# EAGLE design dsky_md_2.3v (EAGLE 6.5.0)
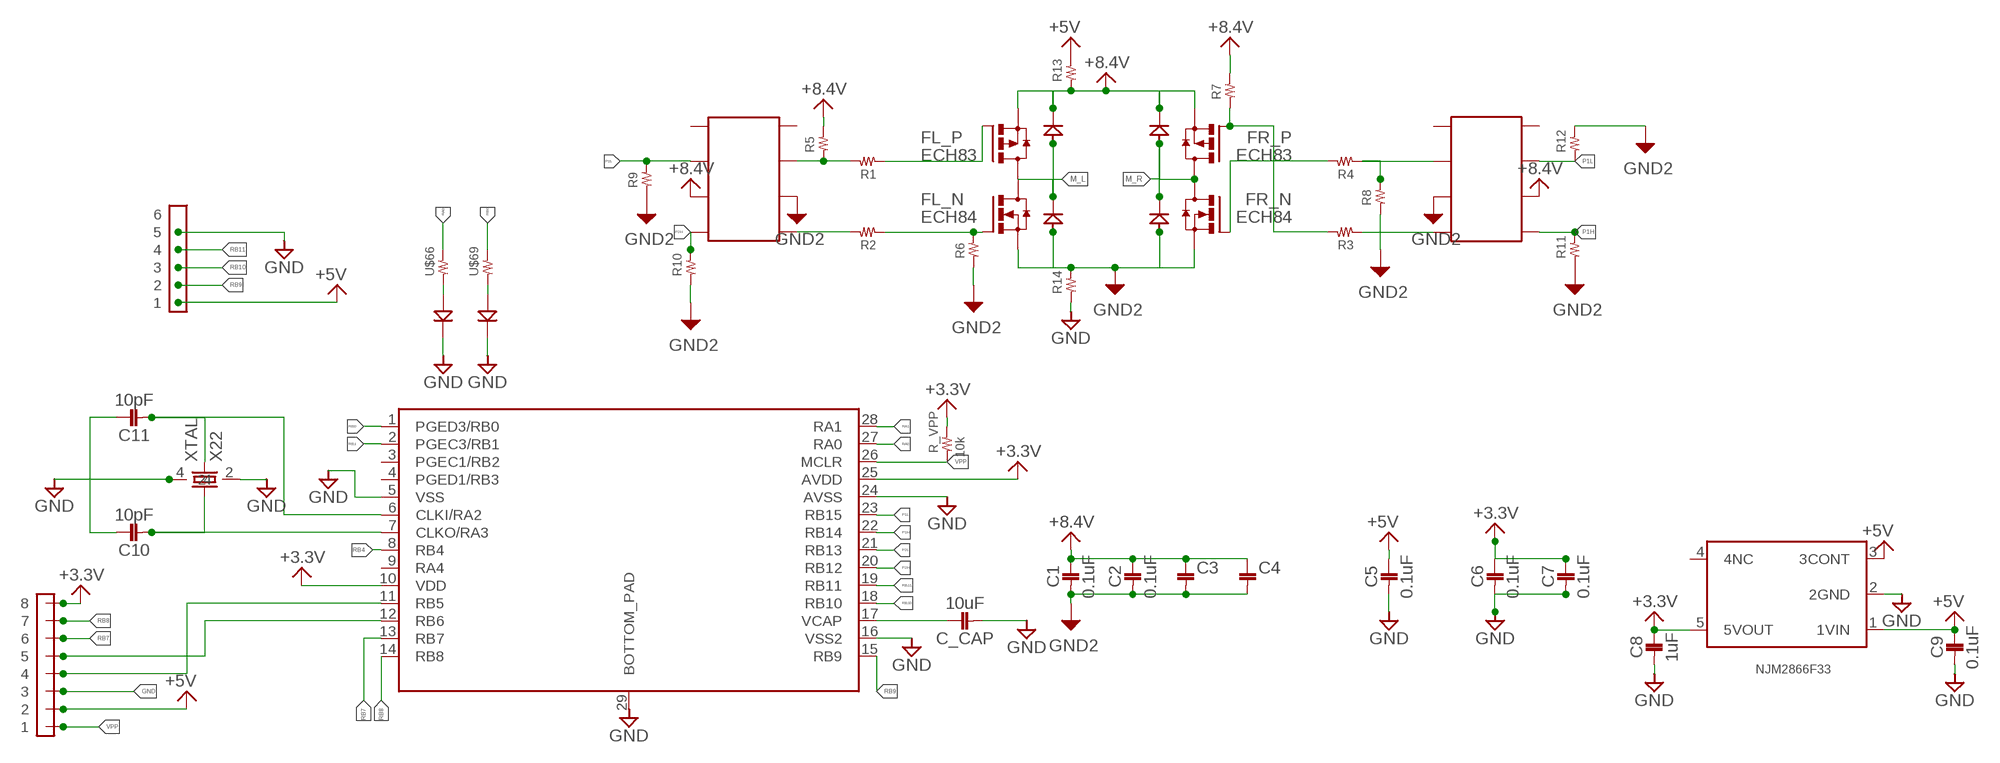
[diagram p0: schematic, sheet 1]

## Parts
C1  0.1uF  1608  [1608]
C2  0.1uF  1608  [1608]
C3  2012  [2012]
C4  2012  [2012]
C5  0.1uF  1608  [1608]
C6  0.1uF  1608  [1608]
C7  0.1uF  1608  [1608]
C8  1uF  1608  [1608]
C9  0.1uF  1608  [1608]
C10  10pF  1608  [1608]
C11  10pF  1608  [1608]
C_CAP  10uF  1608  [1608]
FL_N  ECH84  [ECH8]
FL_P  ECH83  [ECH8]
FR_N  ECH84  [ECH8]
FR_P  ECH83  [ECH8]
IC_L  TC1427COA  [SOIC8]
IC_R  TC1427COA  [SOIC8]
NJM2866F33  TAR5SB  [SSOP5-P-0.95]
R1  RESISTOR__SMD  [1608]
R2  RESISTOR__SMD  [1608]
R3  RESISTOR__SMD  [1608]
R4  RESISTOR__SMD  [1608]
R5  RESISTOR__SMD  [1608]
R6  RESISTOR__SMD  [1608]
R7  RESISTOR__SMD  [1608]
R8  RESISTOR__SMD  [1608]
R9  RESISTOR__SMD  [1608]
R10  RESISTOR__SMD  [1608]
R11  RESISTOR__SMD  [1608]
R12  RESISTOR__SMD  [1608]
R13  RESISTOR__SMD  [1608]
R14  RESISTOR__SMD  [1608]
R_VPP  10k  RESISTOR__SMD  [1608]
U$3  SS2040  [SOD-123FL]
U$5  DSPIC33EP32MC202  [QFN-S28_6X6MC]
U$6  1608  [1608]
U$16  1608  [1608]
U$44  FH12-6S-0.5  [FPC6]
U$66  RESISTOR__SMD  [1608]
U$69  RESISTOR__SMD  [1608]
U$70  SS2040  [SOD-123FL]
U$71  SS2040  [SOD-123FL]
U$73  SS2040  [SOD-123FL]
U$80  PIN_HEADER_8  [PIN_HEADER_8]
XTAL  X22  [SMD_X22]

## Nets
+3.3V: C6.P$1 C7.P$1 C8.P$1 NJM2866F33.5(5VOUT) R_VPP.2 U$5.10(VDD) U$5.25(AVDD) U$80.8
+5V: C5.P$1 C9.P$1 NJM2866F33.1(1VIN) NJM2866F33.3(3CONT) R13.2 U$44.P1 U$80.2
+8.4V: C1.P$1 C2.P$1 C3.1 C4.1 FL_P.1(S) FL_P.2(S) FL_P.3(S) FR_P.1(S) FR_P.2(S) FR_P.3(S) IC_L.3(3_GND) IC_R.3(3_GND) R5.2 R7.2 R13.1 U$70.2(PK) U$73.2(PK)
GND: C5.P$2 C6.P$2 C7.P$2 C8.P$2 C9.P$2 C10.P$1 C11.P$1 C_CAP.P$2 NJM2866F33.2(2GND) R14.1 U$5.5(VSS) U$5.16(VSS2) U$5.24(AVSS) U$5.29(BOTTOM_PAD) U$6.2(K) U$16.2(K) U$44.P5 U$44.P_NC1 U$44.P_NC2 U$80.3 XTAL.2 XTAL.4
GND2: C1.P$2 C2.P$2 C3.2 C4.2 FL_N.1(S) FL_N.2(S) FL_N.3(S) FR_N.1(S) FR_N.2(S) FR_N.3(S) IC_L.6(6_VDD) IC_R.6(6_VDD) R6.1 R8.1 R9.1 R10.1 R11.1 R12.2 R14.2 U$3.1(PA) U$71.1(PA)
M_L: FL_N.5(D) FL_N.6(D) FL_N.7(D) FL_N.8(D) FL_P.5(D) FL_P.6(D) FL_P.7(D) FL_P.8(D) U$3.2(PK) U$70.1(PA)
M_R: FR_N.5(D) FR_N.6(D) FR_N.7(D) FR_N.8(D) FR_P.5(D) FR_P.6(D) FR_P.7(D) FR_P.8(D) U$71.2(PK) U$73.1(PA)
N$1: FL_P.4(G) R1.1
N$2: FL_N.4(G) R2.1 R6.2
N$3: IC_L.7(7_OUT_A) R1.2 R5.1
N$4: FR_P.4(G) R3.2 R7.1
N$5: IC_L.5(5_OUT_B) R2.2
N$6: IC_R.7(7_OUT_A) R4.1 R8.2
N$7: C_CAP.P$1 U$5.17(VCAP)
N$8: C10.P$2 U$5.7(CLKO/RA3) XTAL.1
N$9: IC_R.5(5_OUT_B) R3.1
N$10: U$5.11(RB5) U$80.4
N$11: U$5.12(RB6) U$80.5
N$12: FR_N.4(G) R4.2
N$13: C11.P$2 U$5.6(CLKI/RA2) XTAL.3
N$14: U$6.1(A) U$66.1
N$16: U$16.1(A) U$69.1
P1H: IC_R.4(4_IN_B) R11.2 U$5.22(RB14)
P1L: IC_R.2(2_IN_A) R12.1 U$5.23(RB15)
P2H: IC_L.4(4_IN_B) R10.2 U$5.20(RB12)
P2L: IC_L.2(2_IN_A) R9.2 U$5.21(RB13)
RA0: U$5.27(RA0) U$66.2
RA1: U$5.28(RA1)
RB0: U$5.1(PGED3/RB0) U$69.2
RB1: U$5.2(PGEC3/RB1)
RB4: U$5.8(RB4)
RB7: U$5.13(RB7) U$80.6
RB8: U$5.14(RB8) U$80.7
RB9: U$5.15(RB9) U$44.P2
RB10: U$5.18(RB10) U$44.P3
RB11: U$5.19(RB11) U$44.P4
VPP: R_VPP.1 U$5.26(MCLR) U$80.1
Unconnected: IC_L.1(1_NC) IC_L.8(8_NC) IC_R.1(1_NC) IC_R.8(8_NC) NJM2866F33.4(4NC) U$5.3(PGEC1/RB2) U$5.4(PGED1/RB3) U$5.9(RA4) U$44.P6

## Library data of the parts
C1 C2 C5-C11 C_CAP = 02_C:1608
C3 C4 = 02_C:2012
FL_N FR_N = 06_FET:ECH84
FL_P FR_P = 06_FET:ECH83
IC_L IC_R = 04_IC:TC1427COA
NJM2866F33 = 04_IC:TAR5SB
R1-R14 R_VPP U$66 U$69 = 01_R:RESISTOR__SMD
U$3 U$70 U$71 U$73 = DIODE:SS2040
U$5 = microchip-dspic:DSPIC33EP32MC202
U$6 U$16 = LED:1608
U$44 = 08_CONECTOR:FH12-6S-0.5
U$80 = 08_CONECTOR:PIN_HEADER_8
XTAL = 09_2_CRYSTAL:X22

## Board
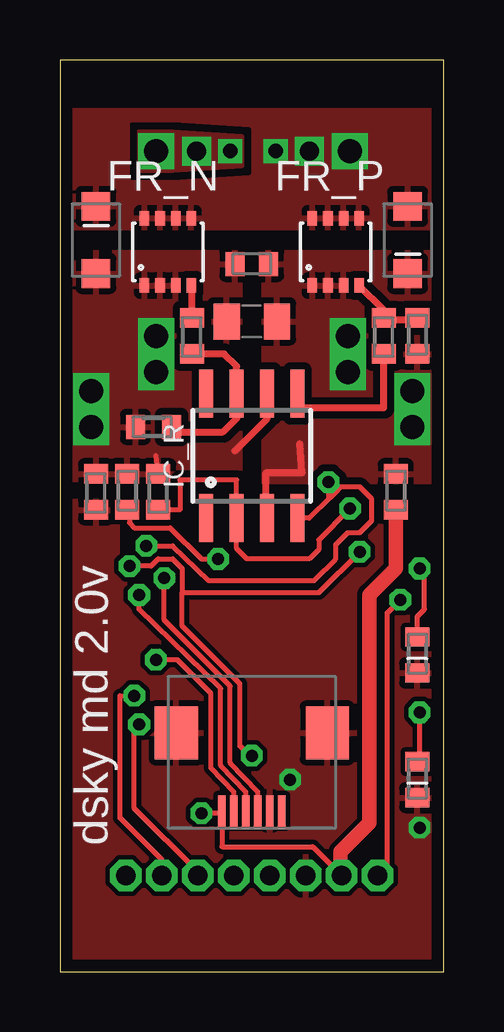
[diagram p1: board, top side]
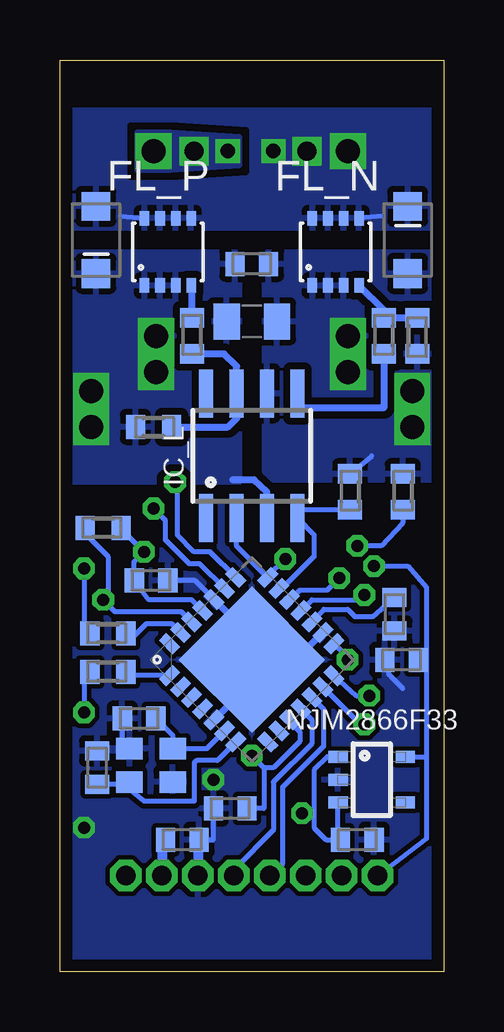
[diagram p2: board, bottom side, seen from below]

Size 16 x 38 mm. Coordinates in mm from the lower left corner, seen from the top.
Outline: 0,0 16,0 16,38 0,38 0,0
Copper layers (1*16): Top 0.035mm / dielectric 1.5mm / Bottom 0.035mm
Design rules "default *": minimum track width 6mil, minimum drill 12mil, track to track 6mil, track to pad 6mil, pad to pad 6mil, via to via 6mil, smd to smd 8mil, copper to edge 20mil, drill to drill 8mil, minimum pad ring 10mil, minimum via ring 8mil, stop-mask expansion 4mil, vias tented up to drill 0mil, thermal gap 10mil

### Footprints (pad centres in the part's own frame; a part is rotated, then mirrored left to right if it is on the bottom)
1608 = smd 0.8 x 1: P$1 -0.7,0; P$2 0.7,0
2012 = smd 1.1 x 1.5: 1 -1.05,0; 2 1.05,0
ECH8 = smd 0.4 x 0.6: 1 -0.975,-1.4; 2 -0.325,-1.4; 3 0.325,-1.4; 4 0.975,-1.4; 5 0.975,1.4; 6 0.325,1.4; 7 -0.325,1.4; 8 -0.975,1.4
SOIC8 = smd 0.6 x 2: 1 -1.905,-2.6; 2 -0.635,-2.6; 3 0.635,-2.6; 4 1.905,-2.6; 5 1.905,2.6; 6 0.635,2.6; 7 -0.635,2.6; 8 -1.905,2.6
SSOP5-P-0.95 = smd 0.5 x 0.8: 1 -0.95,-1.4; 2 0,-1.4; 3 0.95,-1.4; 4 0.95,1.4; 5 -0.95,1.4
1608' = smd 0.8 x 1: 1 -0.75,0; 2 0.75,0
SOD-123FL = smd 1.2 x 1.2: 1 -1.4,0; 2 1.4,0
QFN-S28_6X6MC = smd 0.813 x 0.432: 1 -2.896,1.956; 2 -2.896,1.295; 3 -2.896,0.66; 4 -2.896,0; 5 -2.896,-0.66; 6 -2.896,-1.295; 7 -2.896,-1.956; 15 2.896,-1.956; 16 2.896,-1.295; 17 2.896,-0.66; 18 2.896,0; 19 2.896,0.66; 20 2.896,1.295; 21 2.896,1.956 | smd 0.432 x 0.813: 8 -1.956,-2.896; 9 -1.295,-2.896; 10 -0.66,-2.896; 11 0,-2.896; 12 0.66,-2.896; 13 1.295,-2.896; 14 1.956,-2.896; 22 1.956,2.896; 23 1.295,2.896; 24 0.66,2.896; 25 0,2.896; 26 -0.66,2.896; 27 -1.295,2.896; 28 -1.956,2.896 | smd 4.318 x 4.318: 29 0,0
FPC6 = smd 0.3 x 1.3: P1 -1.25,0; P2 -0.75,0; P3 -0.25,0; P4 0.25,0; P5 0.75,0; P6 1.25,0 | smd 1.8 x 2.2: P_NC1 3.15,3.25; P_NC2 -3.15,3.25
PIN_HEADER_8 = drill 0.8 octagon: 1 -4.5,0; 2 -3,0; 3 -1.5,0; 4 0,0; 5 1.5,0; 6 3,0; 7 4.5,0; 8 6,0
SMD_X22 = smd 1.1 x 0.9: 1 -0.9,-0.7; 2 0.9,-0.7; 3 0.9,0.7; 4 -0.9,0.7

### Placement (x,y rotation side)
C1  8,29.5 180 top
C2  8,29.5 0 bottom
C3  8,27.1 0 bottom
C4  8,27.1 180 top
C5  10.9,5.5 0 bottom
C6  12.2,16.3 0 bottom
C7  8.9,6.8 180 bottom
C8  1.75,13 180 bottom
C9  3.6,5.5 0 bottom
C10  14.45,8.5 270 bottom
C11  12.7,10.55 0 bottom
C_CAP  2.05,14.9 270 bottom
FL_N  4.5,30 0 bottom
FL_P  11.5,30 0 bottom
FR_N  4.5,30 0 top
FR_P  11.5,30 0 top
IC_L  8,21.5 0 bottom
IC_R  8,21.5 0 top
NJM2866F33  3,8 270 bottom
R1  [1608']  10.5,26.5 270 bottom
R2  [1608']  2.5,26.5 270 bottom
R3  [1608']  13.5,26.5 90 top
R4  [1608']  5.5,26.5 90 top
R5  [1608']  12.1,22.7 180 bottom
R6  [1608']  1.1,26.5 90 bottom
R7  [1608']  14.9,26.5 270 top
R8  [1608']  3.9,22.7 0 top
R9  [1608']  2.8,20 270 top
R10  [1608']  3.9,20 270 bottom
R11  [1608']  1.7,20 270 bottom
R12  [1608']  4.1,20 90 top
R13  [1608']  14,20 270 top
R14  [1608']  1.5,20 90 top
R_VPP  10k  [1608']  14.2,18.5 0 bottom
U$3  1.5,30.5 90 bottom
U$5  8,13 45 bottom
U$6  1608  [1608']  14.9,13.2 270 top
U$16  1608  [1608']  14.9,8 270 top
U$44  8,6.7 0 top
U$66  [1608']  14,14.1 0 bottom
U$69  [1608']  14,12.5 0 bottom
U$70  14.5,30.5 270 bottom
U$71  1.5,30.5 90 top
U$73  14.5,30.5 270 top
U$80  8.75,4 180 top
XTAL  12.2,8.6 0 bottom

### Tracks (layer width: path | path; a pad name or v marks a point on that pad's centre or on a via)
+3.3V  (via drill 0.5)
  Top 0.2: v8,9 8,8.9 7.5,9.4 7.5,12 5.1,14.4 5.1,15.8 | v2.9,16.9 3.8,16.9 4.1,17.2 4.7,17.2 5.1,16.8 5.1,15.8 | 5.1,15.8 10.8,15.8 v12.5,17.5
  Bottom 0.2: U$5.25 10.5,15.5 12.3,15.5 C6.P$1 12.9,17.1 v12.5,17.5 13.25,18.25 R_VPP.2 | U$5.10 6.42,10.42 6,10 6,9.6 7.1,8.5 7.5,8.5 | 7.5,8.5 v8,9 | 7.5,8.5 7.5,6.8 C7.P$1 | 0.7,8.95 0.7,12.6 | 0.7,12.6 0.7,16 1.5,16.9 v2.9,16.9 | NJM2866F33.5 0.7,8.95 | U$80.8 0.7,5.55 0.7,8.95 | C8.P$1 0.7,12.6
+5V  (via drill 0.5)
  Top 0.2: 11.75,5.2 U$80.2 10.55,5.2 6.75,5.2 U$44.P1 6.65,6.6 v5.9,6.6
  Top 0.6: R13.2 14,16.8 12.9,15.7 12.9,6.2 11.7,5 11.7,4.05 U$80.2
  Bottom 0.2: 4.35,8.95 NJM2866F33.1 4.85,8.95 5.4,8.4 5.4,6.6 | NJM2866F33.3 4.4,5.5 C9.P$1 4.9,5.5 5.4,6 5.4,6.6 | v5.9,6.6 5.4,6.6
  Bottom 0.406: C5.P$1 11.75,5.3 U$80.2
+8.4V  (via drill 1)
  Top 0.3: IC_R.3 8.6,18.9 8.6,20.8 10.1,20.8 10,22
  Bottom 0.3: IC_L.3 7.37,20 7.9,20.5 8.8,20.5
  other vias: 12,26.5 12,25 14.7,22.7 14.7,24.2
  pour Bottom (isolate 0.3): 8.5,30 16,30 16,20.4 8.5,20.4
  pour Top (isolate 0.3): 8.5,30 16,30 16,20.4 8.5,20.4
GND  (via drill 0.5)
  Bottom 0.2: C11.P$1 13.4,9.6 XTAL.4 | 1.7,11.8 2.3,12.4 2.3,12.6 2.45,12.6 C8.P$2 | U$5.24 10.37,16.3 C6.P$2 | C5.P$2 9.6,5.5 C7.P$2
  Bottom 0.3: U$5.5 8,12.07 U$5.29 | U$5.24 8,13.93 U$5.29 | U$5.16 6.17,13 U$5.29
  Bottom 0.406: C5.P$2 10.25,5.3 U$80.3
  other vias: 15,6 9.6,8
  pour Top (isolate 0.2): 0,0 16,0 16,19.6 3,19.6 3,17.3 2.4,17.3 2.4,19.6 0,19.6
  pour Bottom (isolate 0.2): 0,0 16,0 16,19.6 0,19.6
GND2  (via drill 1)
  Top 0.2: R12.2 4,21.5
  Top 0.3: IC_R.6 8.63,23.04 7.3,21.7
  Bottom 0.2: R10.1 3,21.5
  other vias: 4,26.5 4,25 1.3,22.7 1.3,24.2
  pour Bottom (isolate 0.3): 0,30 7.5,30 7.5,20.5 0,20.5
  pour Top (isolate 0.3): 0,30 7.5,30 7.5,20.5 0,20.5
M_L  (via drill 0.6, 0.8, 1)
  Bottom 0.2: 2.52,31.5 FL_N.5 | 13.47,31.5 FL_P.8
  other vias: 5.7,34.2 4,34.2 7.1,34.2
  pour Bottom (isolate 0.3, rank 2): 0,35.9 16,35.9 16,31 0,31
  pour Top: 3.3,35 3.3,33.4 4.7,33.4 7.6,33.6 7.6,34.8 4.7,35
M_R  (via drill 0.6, 0.8, 1)
  other vias: 10.4,34.2 12.1,34.2 9,34.2
  pour Top (isolate 0.3, rank 2): 0,35.9 16,35.9 16,31 0,31
  pour Bottom: 8.5,34.8 11.4,35 12.8,35 12.8,33.4 11.4,33.4 8.5,33.6
N$1
  Bottom 0.2: 10.5,28.57 FL_P.4
  Bottom 0.3: R1.1 10.5,28.57
N$2
  Bottom 0.3: R6.2 R2.1 2.5,27.57 FL_N.4
N$3
  Bottom 0.3: R1.2 9.15,25.75 8.63,25.23 IC_L.7 8.6,24.07 8.6,23.1 9,22.7 R5.1
N$4
  Top 0.3: R7.1 14.9,27.15 14,27.15 R3.2 13.5,27.57 FR_P.4
N$5
  Bottom 0.3: R2.2 2.5,23.5 6,23.5 6,24.1 IC_L.5
N$6
  Top 0.3: R4.1 6.85,25.75 7.37,25.23 IC_R.7 7.4,24.07 7.4,23.1 6.8,22.5 4.7,22.5 R8.2
N$7
  Bottom 0.2: U$5.17 5.49,14.61 5,15.1 4,15.1 3.7,14.8 2.95,14.8 C_CAP.P$1
N$8
  Bottom 0.2: C10.P$2 13.2,7.8 XTAL.1 13.05,7.55 12.5,7.1 10.4,7.1 10.4,8.7 10.3,8.8 9.43,8.8 U$5.7
N$9
  Top 0.3: IC_R.5 9.9,23.59 10,23.5 13.5,23.5 R3.1
N$10
  Bottom 0.2: U$5.11 5.5,10.5 5.5,9.5 7.1,7.9 7.1,5.9 8.75,4.25 U$80.4
N$11
  Bottom 0.2: U$80.5 7.3,4 6.7,4.5 6.7,7.7 5,9.4 5,10.93 U$5.12
N$12
  Top 0.3: R4.2 5.5,28.6 FR_N.4
N$13
  Bottom 0.2: U$5.6 9.87,9.3 XTAL.3 11.3,9.85 C11.P$2
N$14  (via drill 0.5)
  Top 0.2: U$6.1 14.9,14.8 15.2,15.1 15.2,16.6 v15,16.8
  Bottom 0.2: v15,16.8 15,14.35 U$66.1
N$16  (via drill 0.5)
  Top 0.2: v15,10.8 15,8.85 U$16.1
  Bottom 0.2: U$69.1 15,12.25 v15,10.8
P1H  (via drill 0.5)
  Top 0.2: v3.6,17.75 4.7,17.75 6.2,16.3 10.6,16.3 11.5,17.2 11.5,17.8 12,18.3 12.5,18.3 13,18.8 13,19.7 12.5,20.2 11.7,20.2 11.5,20 | 11.5,20 11.25,19.75 | 11.25,19.75 10.4,18.9 IC_R.4 | 11.4,20 11.5,20 | v11.2,20.4 11.2,19.8 arc90 11.25,19.75
  Bottom 0.2: R11.2 1.7,18.7 2.6,17.75 v3.6,17.75 | U$5.22 9.73,17.5 10.4,17.5 11.1,18.2 11.1,20.4 v11.2,20.4
P1L  (via drill 0.5)
  Top 0.2: R12.1 5,19.25 5,20.5 7.37,20.5 IC_R.2 7.37,17.64 7.8,17.2 10.4,17.2 10.8,17.6 10.8,18 v12.1,19.3
  Bottom 0.2: U$5.23 10.17,17 10.6,17 11.6,18 11.6,18.8 v12.1,19.3
P2H
  Bottom 0.2: R10.2 5.75,19.25 arc-90 IC_L.4 5.4,18.2 5.4,17.3 6.74,15.96 U$5.20
P2L  (via drill 0.5)
  Top 0.2: R9.2 2.9,19.15 2.9,18.7 3.1,18.5 4.6,18.5 5.9,17.2 v6.6,17.2
  Bottom 0.2: IC_L.2 8.63,17.73 U$5.21 7.33,16.46 v6.6,17.2
RA0
  Bottom 0.2: U$5.27 11.33,14.5 12.4,14.5 12.9,14 U$66.2
RB0
  Bottom 0.2: U$5.1 13.25,12.34 U$69.2
RB7  (via drill 0.5)
  Top 0.2: U$80.6 5.75,4.15 3.1,6.8 3.1,10.3 v3.3,10.3
  Bottom 0.2: U$5.13 3.47,10.3 v3.3,10.3
RB8  (via drill 0.5)
  Top 0.2: U$80.7 4.25,4.65 2.5,6.4 2.5,11.5 v3.1,11.5
  Bottom 0.2: U$5.14 3.63,11.5 v3.1,11.5
RB9  (via drill 0.5)
  Top 0.2: U$44.P2 7.25,7.5 6.3,8.5 6.3,11.6 4.9,13 v4,13
  Bottom 0.2: v4,13 4,13.1 U$5.15
RB10  (via drill 0.5)
  Top 0.2: U$44.P3 7.75,7.5 6.7,8.6 6.7,11.8 3.3,15.1 v3.3,15.7
  Bottom 0.2: U$5.18 5.5,15.5 3.5,15.5 v3.3,15.7
RB11  (via drill 0.5)
  Top 0.2: U$44.P4 8.25,7.5 7.1,8.7 7.1,11.9 4.35,14.65 v4.35,16.4
  Bottom 0.2: U$5.19 6.39,15.51 6,15.9 4.85,15.9 v4.35,16.4
VPP  (via drill 0.5)
  Top 0.2: v14.2,15.5 13.65,14.95 13.65,4.4 U$80.1
  Bottom 0.2: U$5.26 10.93,15 13.7,15 v14.2,15.5 14,15.7 14,17.3 15,18.3 14.7,18.5 R_VPP.1

### Text on the board
tPlace: dsky md 2.0v